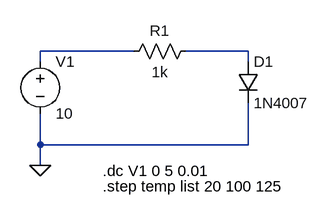
[diagram p0: schematic TP2DEtemp.asc]
TP2DEtemp.asc, the LTspice schematic file:
Version 4.1
SHEET 1 880 680
WIRE 112 96 -32 96
WIRE 288 96 192 96
WIRE -32 112 -32 96
WIRE 288 112 288 96
WIRE -32 240 -32 192
WIRE 288 240 288 176
WIRE 288 240 -32 240
WIRE -32 272 -32 240
FLAG -32 272 0
SYMBOL diode 272 112 R0
SYMATTR InstName D1
SYMATTR Value 1N4007
SYMBOL res 208 80 R90
WINDOW 0 0 56 VBottom 2
WINDOW 3 32 56 VTop 2
SYMATTR InstName R1
SYMATTR Value 1k
SYMBOL voltage -32 96 R0
WINDOW 123 0 0 Left 0
WINDOW 39 0 0 Left 0
SYMATTR InstName V1
SYMATTR Value 10
TEXT 64 280 Left 2 !.dc V1 0 5 0.01
TEXT 64 304 Left 2 !.step temp list 20 100 125

The netlist it stands for:
* TP2DEtemp.asc
D1 N002 0 1N4007
R1 N002 N001 1k
V1 N001 0 10
.model D D
.lib standard.dio
.dc V1 0 5 0.01
.step temp list 20 100 125
.backanno
.end